# Altium schematic sheet Alarm.SchDoc
size A
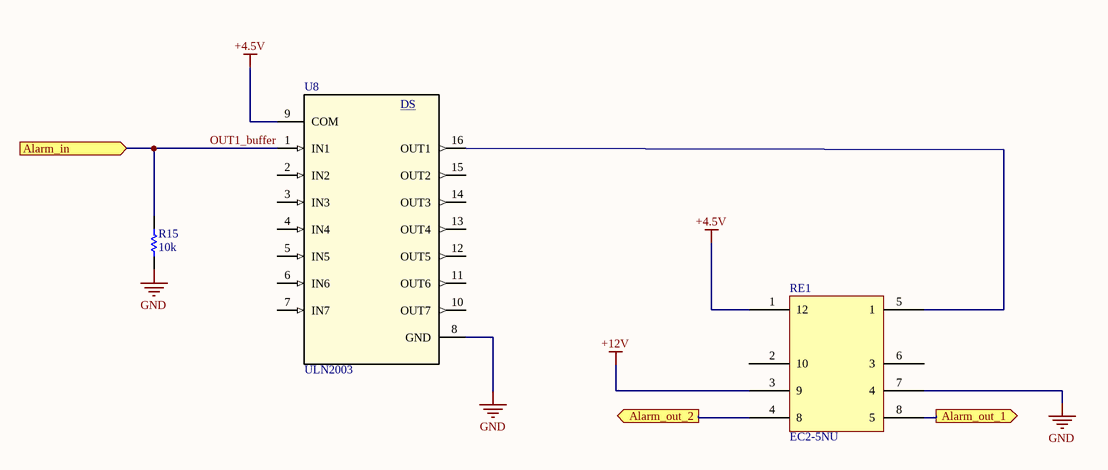
[diagram p0: Alarm.SchDoc]

## Parts
R15  value 10k  [R-805]  (hidden comment: R-805)
RE1  EC2-5NU  [EC2-5NU]
U8  ULN2003  [ULN20003]

## Ports
Alarm_in (in), Alarm_out_1 (out), Alarm_out_2 (out)

## Nets
+4.5V: RE1.1(12) U8.9(COM)
+12V: RE1.3(9)
GND: R15.1 RE1.7(4) U8.8(GND)
Alarm_out_1: RE1.8(5) ; port Alarm_out_1
Alarm_out_2: RE1.4(8) ; port Alarm_out_2
OUT1_buffer: R15.2 U8.1(IN1) ; port Alarm_in
NetRE1_5: RE1.5(1) U8.16(OUT1)

Not connected (* = marked no-connect by the designer): RE1 2(10) 6(3); U8 2(IN2) 3(IN3) 4(IN4) 5(IN5) 6(IN6) 7(IN7) 10(OUT7) 11(OUT6) 12(OUT5) 13(OUT4) 14(OUT3) 15(OUT2)

## Notes on the sheet
- (in symbol ULN2003) DS

## Library data of the parts
R15 = R-805: Resistor
RE1 = EC2_5NU
U8 = ULN2003: No Description Available; PartNumber: ULN2003ADR; Manufacturer: Texas Instruments; RefDes: RefDes; Type: DEV; Value: Value; Copyright: Copyright (C) 2018 Accelerated Designs. All rights reserved